# Altium schematic sheet STX-3542-5N-G-TR1_STX-3542-5N-G-TR.schdoc
size 127 x 99 mm
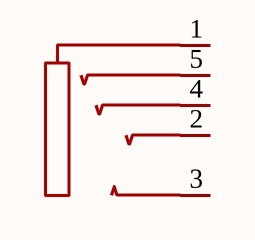
[diagram p0: STX-3542-5N-G-TR1_STX-3542-5N-G-TR.schdoc]

## Parts
CN?  STX-3542-5N-G-TR  [AUDIO-SMD_STX-3542-5N-G-TR]  (value not drawn)

## Nets

Not connected (* = marked no-connect by the designer): CN? 1 2 3 4 5

## Library data of the parts
CN? = STX-3542-5N-G-TR: Manufacturer: Kycon; Add into BOM: yes; Symbol: STX-3542-5N-G-TR; Device: STX-3542-5N-G-TR; LCSC Part Name: STX-3542-5N-G-TR; Supplier Part: C19843234; Manufacturer Part: STX-3542-5N-G-TR; Supplier Footprint: -; JLCPCB Part Class: Extended Part; Datasheet: https://atta.szlcsc.com/upload/public/pdf/source/20241016/E745211CC2496536A8BD4A461B5CDBC6.pdf; Supplier: LCSC; Convert to PCB: yes